# EAGLE design u10-minimal (EAGLE 6.5.0)
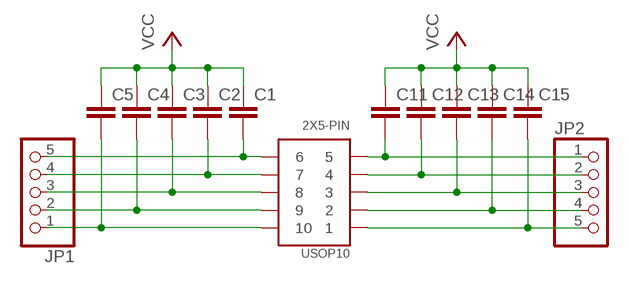
[diagram p0: schematic, sheet 1]

## Parts
C1  C-EUC0603  [C0603]
C2  C-EUC0603  [C0603]
C3  C-EUC0603  [C0603]
C4  C-EUC0603  [C0603]
C5  C-EUC0603  [C0603]
C11  C-EUC0603  [C0603]
C12  C-EUC0603  [C0603]
C13  C-EUC0603  [C0603]
C14  C-EUC0603  [C0603]
C15  C-EUC0603  [C0603]
JP1  PINHD-1X5  [1X05]
JP2  PINHD-1X5  [1X05]
USOP10  2X5-PIN  [USOP10]

## Nets
1: C15.2 JP2.5 USOP10.P$1
2: C14.2 JP2.4 USOP10.P$2
3: C13.2 JP2.3 USOP10.P$3
4: C12.2 JP2.2 USOP10.P$4
5: C11.2 JP2.1 USOP10.P$5
6: C1.2 JP1.5 USOP10.P$6
7: C2.2 JP1.4 USOP10.P$7
8: C3.2 JP1.3 USOP10.P$8
9: C4.2 JP1.2 USOP10.P$9
10: C5.2 JP1.1 USOP10.P$10
VCC: C1.1 C2.1 C3.1 C4.1 C5.1 C11.1 C12.1 C13.1 C14.1 C15.1

## Library data of the parts
C1-C5 C11-C15 = p.peter-rcl:C-EU: CAPACITOR, European symbol
JP1 JP2 = pinhead:PINHD-1X5: PIN HEADER
USOP10 = p.peter-pacakages:2X5-PIN

## Board
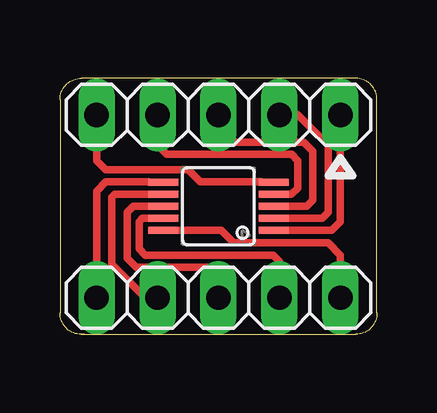
[diagram p1: board, top side]
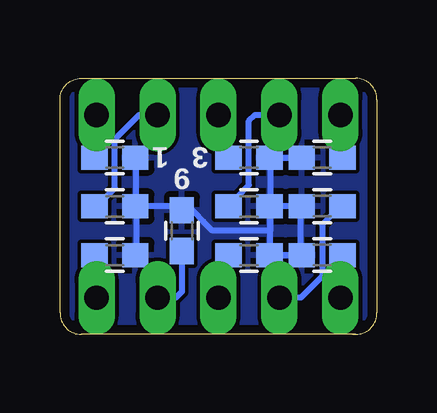
[diagram p2: board, bottom side, seen from below]

Size 13.21 x 10.67 mm. Coordinates in mm from the lower left corner, seen from the top.
Outline: 0.89,0 1.02,0
Outline: 1.02,0 12.32,0 arc90 13.21,0.89 13.21,9.78 arc90 12.32,10.67 0.89,10.67 arc90 0,9.78 0,0.89 arc90 0.89,0
Outline: 1.02,0 0.89,0
Copper layers (1*16): Top 0.0356mm / dielectric 1.5011mm / Bottom 0.0356mm
Design rules "oshpark": minimum track width 6mil, minimum drill 13mil, track to track 6mil, track to pad 6mil, pad to pad 6mil, via to via 6mil, smd to smd 6mil, copper to edge 15mil, drill to drill 6mil, minimum pad ring 7mil, minimum via ring 7mil, stop-mask expansion 4mil, vias tented up to drill 4.1mm, thermal gap 10mil

### Footprints (pad centres in the part's own frame; a part is rotated, then mirrored left to right if it is on the bottom)
C0603 = smd 1.1 x 1: 1 -0.85,0; 2 0.85,0
1X05 = drill 1.016 long: 1 -5.08,0; 2 -2.54,0; 3 0,0; 4 2.54,0; 5 5.08,0
USOP10 = smd 0.3 x 1.25: P$1 -1,-2.3; P$2 -0.5,-2.3; P$3 0,-2.3; P$4 0.5,-2.3; P$5 1,-2.3; P$6 1,2.3; P$7 0.5,2.3; P$8 0,2.3; P$9 -0.5,2.3; P$10 -1,2.3

### Placement (x,y rotation side)
C1  2.29,3.3 0 bottom
C2  2.29,5.33 0 bottom
C3  5.33,3.3 180 bottom
C4  8.13,4.32 270 bottom
C5  10.92,3.3 180 bottom
C11  2.29,7.37 0 bottom
C12  5.33,5.33 180 bottom
C13  5.33,7.37 180 bottom
C14  10.92,5.33 180 bottom
C15  10.92,7.37 180 bottom
JP1  6.6,1.52 180 top
JP2  6.6,9.14 0 top
USOP10  6.6,5.33 90 top

### Tracks (layer width: path | path; a pad name or v marks a point on that pad's centre or on a via)
1
  Top 0.305: JP2.5 11.68,4.7 11.32,4.33 USOP10.P$1
  Bottom 0.254: C15.2 11.68,7.37 JP2.5
2
  Top 0.305: JP2.4 9.91,9.14 11.18,7.87 11.18,5.08 10.93,4.83 USOP10.P$2
  Bottom 0.254: C14.2 11.68,5.33 10.92,6.1 10.92,8.13 9.91,9.14 JP2.4
3
  Top 0.305: JP2.3 6.6,8.38 6.98,8 10.16,8 10.54,7.62 10.54,5.59 10.29,5.33 USOP10.P$3
  Bottom 0.254: C13.2 6.48,7.37 6.6,7.49 JP2.3
4
  Top 0.305: JP2.2 4.06,7.87 4.45,7.49 9.65,7.49 9.91,7.24 9.91,6.1 9.64,5.83 USOP10.P$4
  Bottom 0.254: C12.2 6.18,5.37 5.84,5.71 5.33,6.22 5.33,8.89 5.08,9.14 JP2.2
5
  Top 0.305: JP2.1 1.52,7.24 1.78,6.98 1.91,6.86 5.33,6.86 5.84,6.35 8.38,6.35 8.4,6.33 USOP10.P$5
  Bottom 0.406: C11.2 1.52,7.37 JP2.1
6
  Top 0.305: USOP10.P$6 3.7,6.33 3.68,6.35 1.91,6.35 1.52,5.97 JP1.5
  Bottom 0.305: JP1.5 1.52,3.21 C1.2
7
  Top 0.305: USOP10.P$7 3.82,5.83 3.81,5.84 2.29,5.84 2.16,5.71 2.16,2.92 3.56,1.52 JP1.4
  Bottom 0.254: C2.2 1.52,5.33 2.29,4.57 2.29,2.41 3.18,1.52 JP1.4
8
  Top 0.305: USOP10.P$8 3.81,5.33 3.05,5.33 2.79,5.08 2.79,3.18 3.18,2.79 6.35,2.79 6.6,2.54 JP1.3
  Bottom 0.254: C3.2 6.48,3.3 6.6,3.18 JP1.3
9
  Top 0.305: USOP10.P$9 3.44,4.83 3.3,4.7 3.3,3.56 3.56,3.3 8.89,3.3 9.14,3.05 JP1.2
  Bottom 0.254: C4.2 8.13,1.78 8.38,1.52 JP1.2
10
  Top 0.305: USOP10.P$10 6.71,4.33 7.24,3.81 11.18,3.81 11.68,3.3 JP1.1
  Bottom 0.254: C5.2 11.81,3.3 11.68,3.3 JP1.1
VCC
  Bottom 0.254: 3.18,7.37 C11.1 4.45,7.37 | 4.45,7.37 C13.1 4.45,7.37 | C14.1 10.03,5.33 | 10.03,5.33 10.03,7.33 C15.1 | C1.1 3.18,3.3 | 3.18,3.3 4.45,3.3 | 4.45,3.3 C3.1 | 4.45,7.37 4.45,5.46 | 4.45,5.46 4.45,5.37 C12.1 3.18,5.33 C2.1 3.18,5.29 3.18,3.3 | C3.1 4.45,3.3 | 4.45,3.3 3.18,3.3 | C3.1 4.45,3.3 | 4.45,3.3 4.45,4.32 | 4.45,4.32 4.45,5.46 | 4.45,5.46 4.45,4.32 | 4.45,4.32 6.86,4.32 7.24,4.7 7.62,5.08 7.75,5.21 8.09,5.21 C4.1 8.13,5.33 10.03,5.33 | 10.03,5.33 C14.1 | C14.1 10.03,5.33 | 10.03,5.33 10.03,3.34 C5.1
  pour Bottom (isolate 0.152): 0,0 13.21,0 13.21,10.67 0,10.67

### Text on the board
bPlace: 3 | 1 | 9